# Altium schematic sheet SDConnection.SchDoc
size A4; SheetNumber: 4; SheetTotal: 6
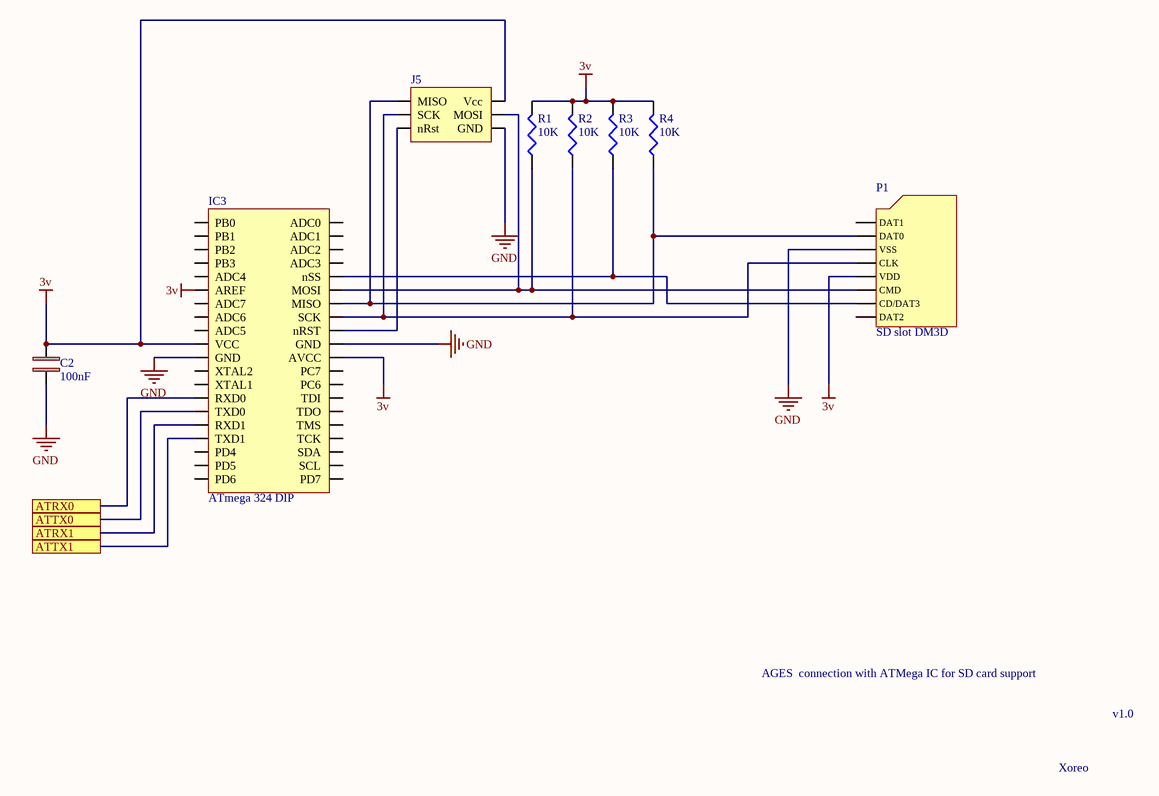
[diagram p0: SDConnection.SchDoc]

## Parts
C2  100nF  [CAPACITOR 1206]
IC3  ATmega 324 DIP  [DIP40 HDR]
J5  2x3 male pin header  [2X3 HDR]  (value not drawn)
P1  SD slot DM3D  [SD SLOT]
R1  10K  [RESISTOR 0805]
R2  10K  [RESISTOR 0805]
R3  10K  [RESISTOR 0805]
R4  10K  [RESISTOR 0805]

## Ports
ATRX0, ATRX1, ATTX0, ATTX1

## Nets
3v: C2.1 IC3.10(VCC) IC3.30(AVCC) IC3.32(AREF) J5.2(Vcc) P1.4(VDD) R1.2 R2.2 R3.2 R4.2
GND: C2.2 IC3.11(GND) IC3.31(GND) J5.6(GND) P1.6(VSS)
ATRX0: IC3.14(RXD0) ; port ATRX0
ATRX1: IC3.16(RXD1) ; port ATRX1
ATTX0: IC3.15(TXD0) ; port ATTX0
ATTX1: IC3.17(TXD1) ; port ATTX1
NetIC3_5: IC3.5(nSS) P1.2(CD/DAT3) R3.1
NetIC3_6: IC3.6(MOSI) J5.4(MOSI) P1.3(CMD) R1.1
NetIC3_7: IC3.7(MISO) J5.1(MISO) P1.7(DAT0) R4.1
NetIC3_8: IC3.8(SCK) J5.3(SCK) P1.5(CLK) R2.1
NetIC3_9: IC3.9(nRST) J5.5(nRst)

Not connected (* = marked no-connect by the designer): IC3 1(PB0) 2(PB1) 3(PB2) 4(PB3) 12(XTAL2) 13(XTAL1) 18(PD4) 19(PD5) 20(PD6) 21(PD7) 22(SCL) 23(SDA) 24(TCK) 25(TMS) 26(TDO) 27(TDI) 28(PC6) 29(PC7) 33(ADC7) 34(ADC6) 35(ADC5) 36(ADC4) 37(ADC3) 38(ADC2) 39(ADC1) 40(ADC0); P1 1(DAT2) 8(DAT1)

## Notes on the sheet
- AGES  connection with ATMega IC for SD card support
- v1.0
- Xoreo

## Library data of the parts
C2 = Capacitor: 100nF: Ceramic capacitor SMD-1206 100nF /50V X7R# K +-10%, AVX, RoHS, /4000 reel/; Manufacturer: Kyocera AVX; Manufacturer Part Number: 12065C104KAT2A; Tolerance: 10%; Voltage Rating: 50V; Dielectric: X7R; Insulation Resistance: 100GR; Dissipation Factor: 2.5%; Supplier 1: Farnell; RoHS: Yes; Category: Ceramic Capacitors; Stock 1: 188000; Pricing 1: 4000=0,02600, 20000=0,02520, 40000=0,02440 (EUR); Mount: Surface Mount,PCB; Case/Package: 1206; Number of Pins: 2; Case Code (Metric): 3216; Case Code (Imperial): 1206; Dielectric Material: Ceramic; Contact Plating: Tin,Matte; Min Operating Temperature: -55°C; Max Operating Temperature: 125°C; Packaging: Tape and Reel; Capacitance: 100nF; Voltage Rating (DC): 50V; Voltage: 50V; Series: -; Package Quantity: 1; Termination: SMD/SMT; Construction: Flat; Length: 3.2mm; Width: 1.6mm; Height: 0.94mm; Depth: 1.6mm; Thickness: 0.037inch; Radiation Hardening: No; Lead Free: Lead Free; RoHS Compliant: Yes; Reach SVHC Compliant: Yes; ComponentLink1URL: https://datasheet.ciiva.com/11786/0900766b80ed4be2-11786988.pdf?src-supplier=Rs; ComponentLink1Description: https://datasheet.ciiva.com/11786/0900766b80ed4be2-11786988.pdf?src-supplier=Rs; ComponentLink2URL: https://datasheet.ciiva.com/2988/cx7r-2988135.pdf?src-supplier=Avnet; ComponentLink2Description: https://datasheet.ciiva.com/2988/cx7r-2988135.pdf?src-supplier=Avnet; ComponentLink3URL: https://datasheet.ciiva.com/16375/cx7r-16375719.pdf?src-supplier=Future+Electronics; ComponentLink3Description: https://datasheet.ciiva.com/16375/cx7r-16375719.pdf?src-supplier=Future+Electronics; ComponentLink4URL: https://datasheet.ciiva.com/2988/cx7r-2988136.pdf?src-supplier=Avnet; ComponentLink4Description: https://datasheet.ciiva.com/2988/cx7r-2988136.pdf?src-supplier=Avnet; ComponentLink5URL: https://datasheet.ciiva.com/7833/cx7r-7833405.pdf?src-supplier=Element14; ComponentLink5Description: https://datasheet.ciiva.com/7833/cx7r-7833405.pdf?src-supplier=Element14; ComponentLink6URL: https://datasheet.ciiva.com/25796/cx7r-25796358.pdf?src-supplier=Farnell; ComponentLink6Description: https://datasheet.ciiva.com/25796/cx7r-25796358.pdf?src-supplier=Farnell; ComponentLink7URL: https://datasheet.ciiva.com/7833/cx7r-7833402.pdf?src-supplier=Element14; ComponentLink7Description: https://datasheet.ciiva.com/7833/cx7r-7833402.pdf?src-supplier=Element14; ComponentLink8URL: https://datasheet.ciiva.com/150/cx7r-150390.pdf?src-supplier=Digi-Key; ComponentLink8Description: https://datasheet.ciiva.com/150/cx7r-150390.pdf?src-supplier=Digi-Key; ComponentLink9URL: https://datasheet.ciiva.com/150/cx7r-150389.pdf?src-supplier=Digi-Key; ComponentLink9Description: https://datasheet.ciiva.com/150/cx7r-150389.pdf?src-supplier=Digi-Key; ComponentLink10URL: https://datasheet.ciiva.com/150/cx7r-150391.pdf?src-supplier=Digi-Key; ComponentLink10Description: https://datasheet.ciiva.com/150/cx7r-150391.pdf?src-supplier=Digi-Key; ComponentLink11URL: https://datasheet.ciiva.com/7833/cx7r-7833403.pdf?src-supplier=Element14; ComponentLink11Description: https://datasheet.ciiva.com/7833/cx7r-7833403.pdf?src-supplier=Element14; ComponentLink12URL: https://datasheet.ciiva.com/7833/cx7r-7833404.pdf?src-supplier=Element14; ComponentLink12Description: https://datasheet.ciiva.com/7833/cx7r-7833404.pdf?src-supplier=Element14; ComponentLink13URL: https://datasheet.ciiva.com/5415/cx7r-218113-5415909.pdf?src-supplier=Mouser; ComponentLink13Description: https://datasheet.ciiva.com/5415/cx7r-218113-5415909.pdf?src-supplier=Mouser; ComponentLink14URL: https://datasheet.ciiva.com/14584/70001075-14584956.pdf?src-supplier=Allied+Electronics; ComponentLink14Description: https://datasheet.ciiva.com/14584/70001075-14584956.pdf?src-supplier=Allied+Electronics; Supplier Part Number 1: 2281081
IC3 = IC: ATmega324: 8-bit AVR MCU, 32 KB, 2048 Bytes, 20 MHz, 1.8 to 5.5V, PDIP-40, RoHS; Manufacturer: Microchip; Manufacturer Part Number: ATMEGA324PA-PU; Min Supply Voltage: 1.8V; Interface: I2C,SPI,UART,USART,2-Wire; Frequency: 20MHz; RAM Size: 2KB; Number of I/Os: 32; Number of Timers/Counters: 3; Oscillator Type: Internal; Data Bus Width: 8b; Watchdog Timer: Yes; Memory Type: FLASH; Memory Size: 32KB; Peripherals: Brown-out Detect/Reset,POR,PWM,WDT; Number of PWM Channels: 6; Number of ADC Channels: 8; Number of SPI Channels: 1; Supplier 1: Farnell; RoHS: Yes; Category: Uncategorized; Stock 1: 132; Pricing 1: 1=5,70000, 25=5,22000, 100=5,13000 (EUR); Mount: Through Hole; Case/Package: PDIP; Number of Pins: 40; Contact Plating: Tin,Matte; Min Operating Temperature: -40°C; Max Operating Temperature: 85°C; Max Supply Voltage: 5.5V; Package Quantity: 10; Packaging: Rail/Tube; Number of Programmable I/O: 32; Max Frequency: 20MHz; Core Architecture: AVR; Series: AVR® ATmega; Number of I2C Channels: 1; Length: 52.58mm; Width: 13.97mm; Height: 4.445mm; RoHS Compliant: Yes; Reach SVHC Compliant: Yes; ComponentLink1URL: https://datasheet.ciiva.com/1157/atmel-8272-8-bit-avr-microcontroller-atmega164a-pa-324a-pa-644a-pa-1284-p-summary-1157584.pdf?src-supplier=Element14; ComponentLink1Description: https://datasheet.ciiva.com/1157/atmel-8272-8-bit-avr-microcontroller-atmega164a-pa-324a-pa-644a-pa-1284-p-summary-1157584.pdf?src-supplier=Element14; ComponentLink2URL: https://datasheet.ciiva.com/9234/doc8272-9234746.pdf?src-supplier=Avnet; ComponentLink2Description: https://datasheet.ciiva.com/9234/doc8272-9234746.pdf?src-supplier=Avnet; Supplier Part Number 1: 1715485
J5 = Connector: 2x3 Pin: 2x3 Pin header
P1 = SD slot: Memory Card Connectors MICRO SD CD CONN STD SMT PUSHPULL; Manufacturer: Hirose; Manufacturer Part Number: DM3D-SF; Gender: Female; Contact Resistance: 100mR; Current Rating: 500mA; Voltage Rating (AC): 125V; Number of Contacts: 8; Insulation Resistance: 1GR; Pitch: 1.1mm; Supplier 1: Farnell; RoHS: Yes; Category: Memory Connectors; Stock 1: 7247; Pricing 1: 1=1,80000, 10=1,48000, 100=1,28000, 500=1,18000, 1000=0,93700, 2500=0,91800 (EUR); Mount: Surface Mount; Contact Material: Copper Alloy,Copper; Contact Plating: Gold; Housing Material: Polymer; Min Operating Temperature: -25°C; Max Operating Temperature: 85°C; Number of Rows: 1; Package Quantity: 1; Packaging: Tape and Reel; Max Current Rating: 500mA; Connector Type: Connector; Termination: Solder; Orientation: Right Angle; Series: DM3; Max Voltage Rating (AC): 125V; Length: 11.95mm; Width: 11.95mm; Depth: 11.45mm; Radiation Hardening: No; Lead Free: Lead Free; Flammability Rating: UL94 V-0; RoHS Compliant: Yes; Reach SVHC Compliant: Yes; ComponentLink1URL: https://datasheet.ciiva.com/1105/1697167-1105105.pdf?src-supplier=Element14; ComponentLink1Description: https://datasheet.ciiva.com/1105/1697167-1105105.pdf?src-supplier=Element14; ComponentLink2URL: https://datasheet.ciiva.com/11755/0900766b80fd13c1-11755152.pdf?src-supplier=Rs; ComponentLink2Description: https://datasheet.ciiva.com/11755/0900766b80fd13c1-11755152.pdf?src-supplier=Rs; ComponentLink3URL: https://datasheet.ciiva.com/16287/e60900232-16287615.pdf?src-supplier=Future+Electronics; ComponentLink3Description: https://datasheet.ciiva.com/16287/e60900232-16287615.pdf?src-supplier=Future+Electronics; ComponentLink4URL: https://datasheet.ciiva.com/15174/getdatasheetpartid-432464-15174822.pdf?src-supplier=Verical; ComponentLink4Description: https://datasheet.ciiva.com/15174/getdatasheetpartid-432464-15174822.pdf?src-supplier=Verical; ComponentLink5URL: https://datasheet.ciiva.com/3122/e60900232-3122537.pdf?src-supplier=Avnet; ComponentLink5Description: https://datasheet.ciiva.com/3122/e60900232-3122537.pdf?src-supplier=Avnet; ComponentLink6URL: https://datasheet.ciiva.com/683/e60900232-683362.pdf?src-supplier=Digi-Key; ComponentLink6Description: https://datasheet.ciiva.com/683/e60900232-683362.pdf?src-supplier=Digi-Key; ComponentLink7URL: https://datasheet.ciiva.com/683/e60900232-683363.pdf?src-supplier=Digi-Key; ComponentLink7Description: https://datasheet.ciiva.com/683/e60900232-683363.pdf?src-supplier=Digi-Key; ComponentLink8URL: https://datasheet.ciiva.com/683/e60900232-683364.pdf?src-supplier=Digi-Key; ComponentLink8Description: https://datasheet.ciiva.com/683/e60900232-683364.pdf?src-supplier=Digi-Key; ComponentLink9URL: https://datasheet.ciiva.com/22627/1697167-22627974.pdf?src-supplier=Farnell; ComponentLink9Description: https://datasheet.ciiva.com/22627/1697167-22627974.pdf?src-supplier=Farnell; Supplier Part Number 1: 1764377
R1-R4 = Resistor: 10K R: Res Thick Film 0805 10K Ohm 5% 1/8W ±200ppm/°C Molded SMD SMD Paper T/R; Manufacturer: Vishay Dale; Manufacturer Part Number: CRCW080510K0JNEB; Resistance: 10kR; Power Rating: 125mW; Voltage Rating: 150V; Supplier 1: Avnet; RoHS: Yes; Category: Chip SMD Resistors; Stock 1: 90000; Pricing 1: 10000=0,02220, 20000=0,02100, 40000=0,01980, 60000=0,01860, 80000=0,01740, 100000=0,01620, 1000000=0,01500 (USD); Case/Package: 0805; Case Code (Imperial): 0805; Case Code (Metric): 2012; Contact Plating: Tin; Weight: 0.000194oz; Min Operating Temperature: -55°C; Max Operating Temperature: 155°C; Packaging: Tape and Reel; Tolerance: 5%; Resistor Type: Thick Film; Temperature Coefficient: 200ppm/°C; Series: CRCW; Max Power Dissipation: 125mW; Number of Terminations: 2; Termination: SMD/SMT; Package Quantity: 10000; Voltage Rating (DC): 150V; Features: Automotive AEC-Q200; Resistance Tolerance: 5%; Construction: Rectangular; Technology: THICK FILM; Working Voltage: 150V; Length: 0.079inch; Width: 1.25mm; Height: 0.02inch; Depth: 1.25mm; Radiation Hardening: No; RoHS Compliant: Yes; Lead Free: Lead Free; Military Standard: Not; ComponentLink1URL: https://datasheet.ciiva.com/16199/dcrcwe3-16199191.pdf?src-supplier=Future+Electronics; ComponentLink1Description: https://datasheet.ciiva.com/16199/dcrcwe3-16199191.pdf?src-supplier=Future+Electronics; ComponentLink2URL: https://datasheet.ciiva.com/7725/dcrcwe3-7725772.pdf?src-supplier=Element14; ComponentLink2Description: https://datasheet.ciiva.com/7725/dcrcwe3-7725772.pdf?src-supplier=Element14; ComponentLink3URL: https://datasheet.ciiva.com/3258/dcrcwe3-3258030.pdf?src-supplier=Avnet; ComponentLink3Description: https://datasheet.ciiva.com/3258/dcrcwe3-3258030.pdf?src-supplier=Avnet; Supplier Part Number 1: CRCW080510K0JNEB